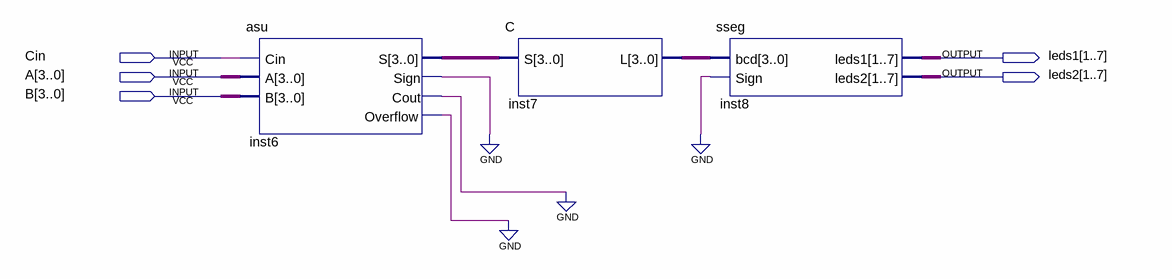
[diagram p0: schematic sheet]
// Quartus schematic PartB.bdf as structural Verilog: 3 symbols, 5 pins
module PartB (
  input  Cin,
  input  [3:0] A,
  input  [3:0] B,
  output [1:7] leds1,
  output [1:7] leds2
);

  wire inst6_cout, inst6_overflow, inst6_sign;
  wire [3:0] inst6_s, inst7_l;

  asu inst6 (.Cin(Cin), .A(A), .B(B), .S(inst6_s), .Sign(inst6_sign), .Cout(inst6_cout), .Overflow(inst6_overflow));
  C inst7 (.S(inst6_s), .L(inst7_l));
  sseg inst8 (.bcd(inst7_l), .Sign(1'b0), .leds1(leds1), .leds2(leds2));
  // also tied to GND on the sheet: {inst6_cout, inst6_overflow, inst6_sign}
endmodule
